# EAGLE design projeto_jcarlos(compacta) (EAGLE 6.2)
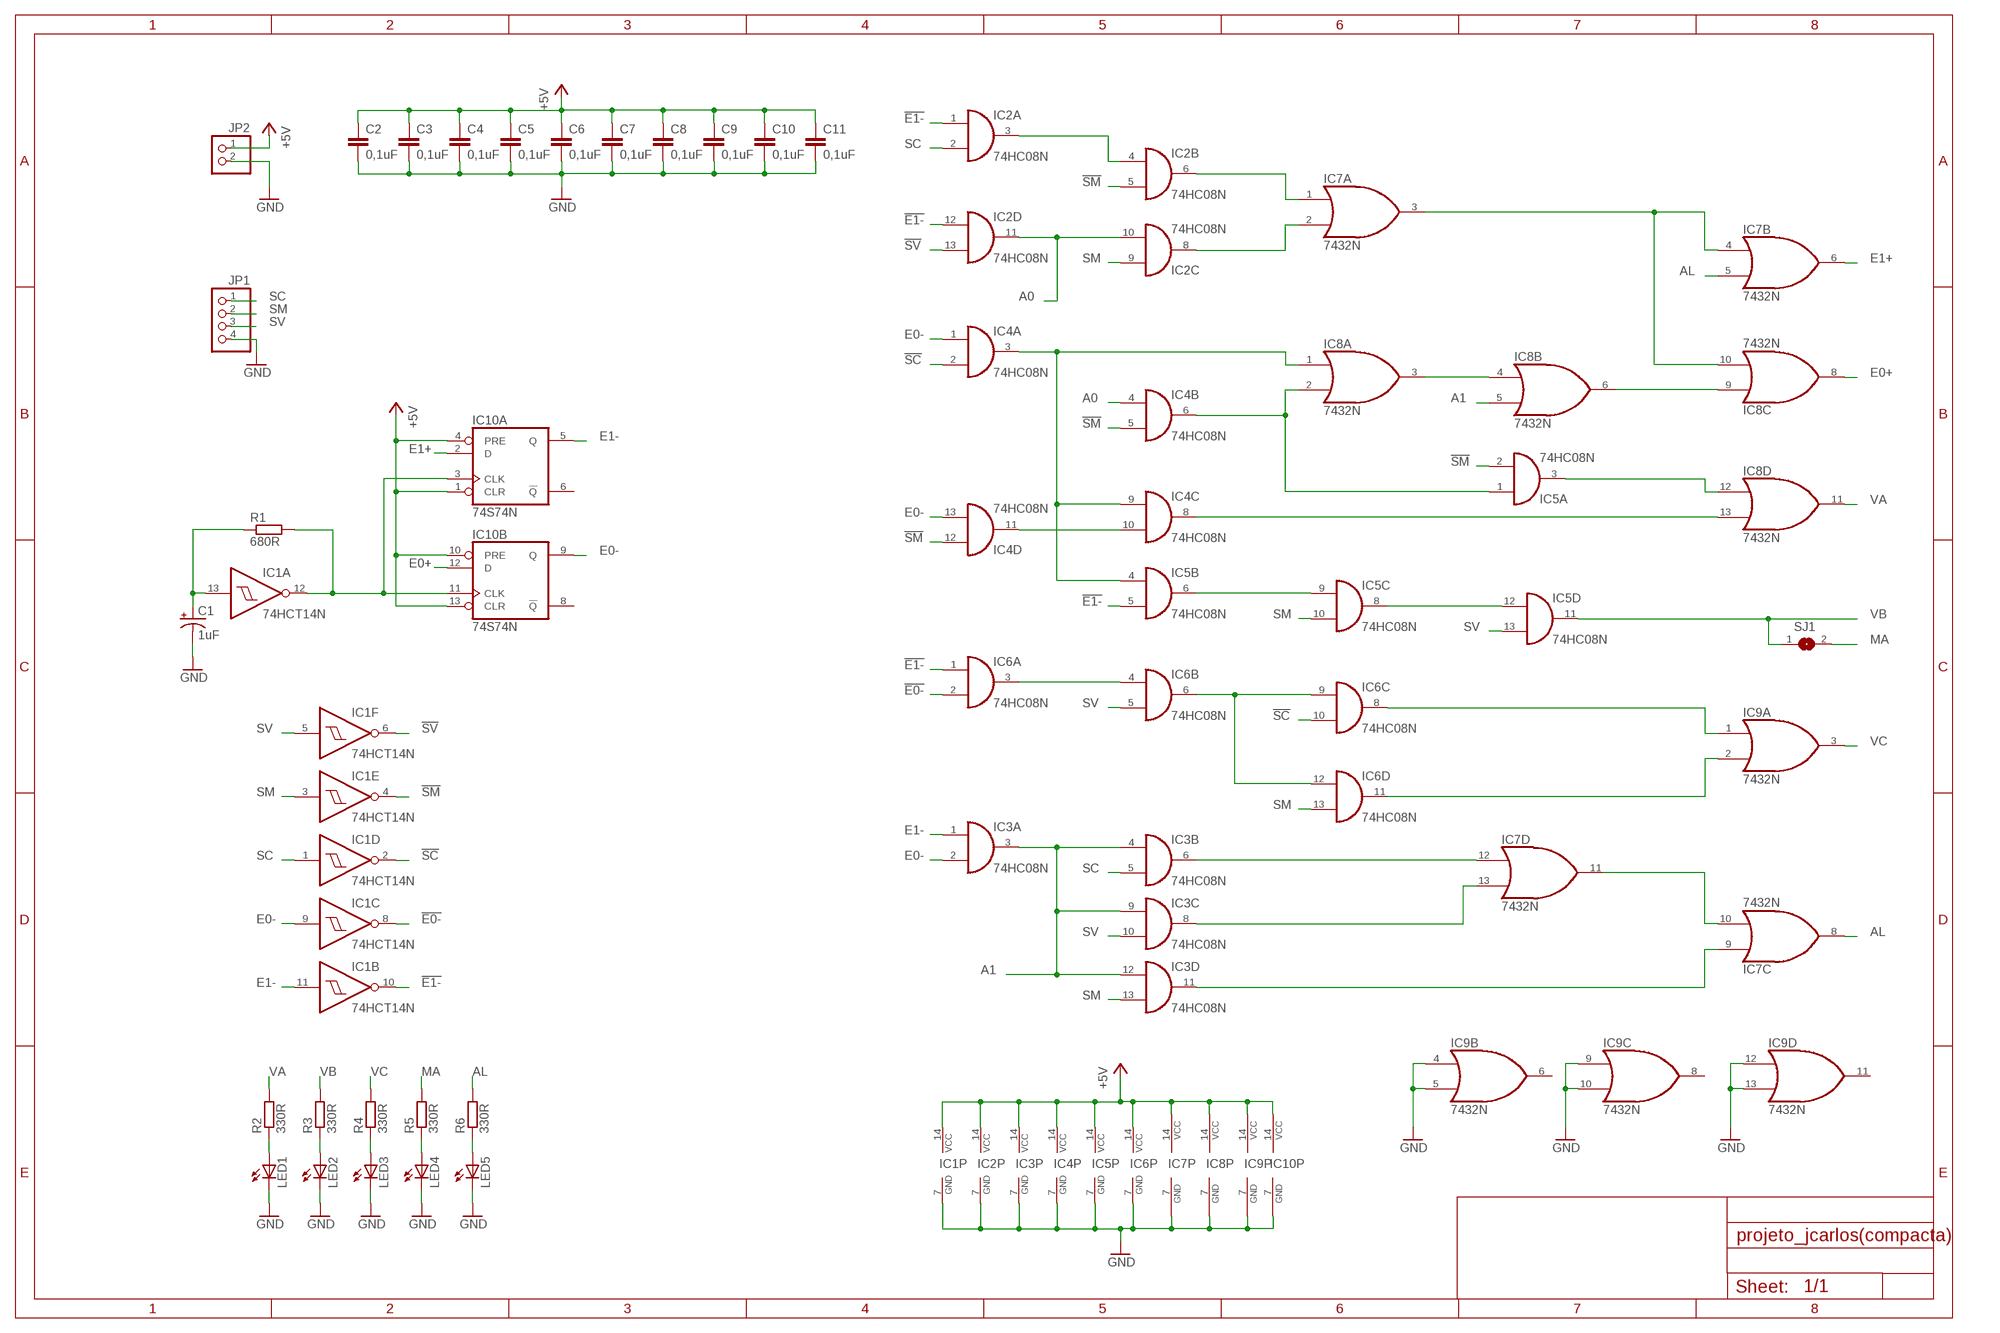
[diagram p0: schematic, sheet 1]

## Parts
C1  1uF  CPOL-USE5-6  [E5-6]
C2  0,1uF  C-EU025-025X050  [C025-025X050]
C3  0,1uF  C-EU025-025X050  [C025-025X050]
C4  0,1uF  C-EU025-025X050  [C025-025X050]
C5  0,1uF  C-EU025-025X050  [C025-025X050]
C6  0,1uF  C-EU025-025X050  [C025-025X050]
C7  0,1uF  C-EU025-025X050  [C025-025X050]
C8  0,1uF  C-EU025-025X050  [C025-025X050]
C9  0,1uF  C-EU025-025X050  [C025-025X050]
C10  0,1uF  C-EU025-025X050  [C025-025X050]
C11  0,1uF  C-EU025-025X050  [C025-025X050]
IC1  74HCT14N  [DIL14]
IC2  74HC08N  [DIL14]
IC3  74HC08N  [DIL14]
IC4  74HC08N  [DIL14]
IC5  74HC08N  [DIL14]
IC6  74HC08N  [DIL14]
IC7  7432N  [DIL14]
IC8  7432N  [DIL14]
IC9  7432N  [DIL14]
IC10  74S74N  [DIL14]
JP1  PINHD-1X4  [1X04]
JP2  PINHD-1X2  [1X02]
LED1  LED5MM  [LED5MM]
LED2  LED5MM  [LED5MM]
LED3  LED5MM  [LED5MM]
LED4  LED5MM  [LED5MM]
LED5  LED5MM  [LED5MM]
R1  680R  R-EU_0204/5  [0204/5]
R2  330R  R-EU_0204/5  [0204/5]
R3  330R  R-EU_0204/5  [0204/5]
R4  330R  R-EU_0204/5  [0204/5]
R5  330R  R-EU_0204/5  [0204/5]
R6  330R  R-EU_0204/5  [0204/5]
SJ1  SJ  [SJ]

## Nets
!E0-: IC1.8(C:O) IC6.2(A:I1)
!E1-: IC1.10(B:O) IC2.1(A:I0) IC2.12(D:I0) IC5.5(B:I1) IC6.1(A:I0)
!SC: IC1.2(D:O) IC4.2(A:I1) IC6.10(C:I1)
!SM: IC1.4(E:O) IC2.5(B:I1) IC4.5(B:I1) IC4.12(D:I0) IC5.2(A:I1)
!SV: IC1.6(F:O) IC2.13(D:I1)
+5V: C2.1 C3.1 C4.1 C5.1 C6.1 C7.1 C8.1 C9.1 C10.1 C11.1 IC1.14(P:VCC) IC2.14(P:VCC) IC3.14(P:VCC) IC4.14(P:VCC) IC5.14(P:VCC) IC6.14(P:VCC) IC7.14(P:VCC) IC8.14(P:VCC) IC9.14(P:VCC) IC10.1(A:CLR) IC10.4(A:PRE) IC10.10(B:PRE) IC10.13(B:CLR) IC10.14(P:VCC) JP2.1
A0: IC2.10(C:I1) IC2.11(D:O) IC4.4(B:I0)
A1: IC3.3(A:O) IC3.4(B:I0) IC3.9(C:I0) IC3.12(D:I0) IC8.5(B:I1)
AL: IC7.5(B:I1) IC7.8(C:O) R6.2
E0+: IC8.8(C:O) IC10.12(B:D)
E0-: IC1.9(C:I) IC3.2(A:I1) IC4.1(A:I0) IC4.13(D:I1) IC10.9(B:Q)
E1+: IC7.6(B:O) IC10.2(A:D)
E1-: IC1.11(B:I) IC3.1(A:I0) IC10.5(A:Q)
GND: C1.- C2.2 C3.2 C4.2 C5.2 C6.2 C7.2 C8.2 C9.2 C10.2 C11.2 IC1.7(P:GND) IC2.7(P:GND) IC3.7(P:GND) IC4.7(P:GND) IC5.7(P:GND) IC6.7(P:GND) IC7.7(P:GND) IC8.7(P:GND) IC9.4(B:I0) IC9.5(B:I1) IC9.7(P:GND) IC9.9(C:I0) IC9.10(C:I1) IC9.12(D:I0) IC9.13(D:I1) IC10.7(P:GND) JP1.4 JP2.2 LED1.K(C) LED2.K(C) LED3.K(C) LED4.K(C) LED5.K(C)
MA: R5.2 SJ1.2
N$1: IC5.6(B:O) IC5.9(C:I0)
N$2: IC7.3(A:O) IC7.4(B:I0) IC8.10(C:I1)
N$3: IC4.10(C:I1) IC4.11(D:O)
N$4: IC4.8(C:O) IC8.13(D:I1)
N$5: IC8.3(A:O) IC8.4(B:I0)
N$6: IC5.3(A:O) IC8.12(D:I0)
N$7: C1.+ IC1.13(A:I) R1.1
N$8: IC1.12(A:O) IC10.3(A:CLK) IC10.11(B:CLK) R1.2
N$9: IC8.6(B:O) IC8.9(C:I0)
N$10: IC4.3(A:O) IC4.9(C:I0) IC5.4(B:I0) IC8.1(A:I0)
N$11: IC5.8(C:O) IC5.12(D:I0)
N$12: IC4.6(B:O) IC5.1(A:I0) IC8.2(A:I1)
N$13: IC2.3(A:O) IC2.4(B:I0)
N$14: LED1.A R2.1
N$15: IC2.6(B:O) IC7.1(A:I0)
N$16: LED2.A R3.1
N$17: LED3.A R4.1
N$18: IC2.8(C:O) IC7.2(A:I1)
N$19: IC3.6(B:O) IC7.12(D:I0)
N$20: IC3.8(C:O) IC7.13(D:I1)
N$21: IC3.11(D:O) IC7.9(C:I0)
N$22: IC7.10(C:I1) IC7.11(D:O)
N$23: LED4.A R5.1
N$24: LED5.A R6.1
N$27: IC6.3(A:O) IC6.4(B:I0)
N$29: IC6.6(B:O) IC6.9(C:I0) IC6.12(D:I0)
N$32: IC6.8(C:O) IC9.1(A:I0)
N$33: IC6.11(D:O) IC9.2(A:I1)
SC: IC1.1(D:I) IC2.2(A:I1) IC3.5(B:I1) JP1.1
SM: IC1.3(E:I) IC2.9(C:I0) IC3.13(D:I1) IC5.10(C:I1) IC6.13(D:I1) JP1.2
SV: IC1.5(F:I) IC3.10(C:I1) IC5.13(D:I1) IC6.5(B:I1) JP1.3
VA: IC8.11(D:O) R2.2
VB: IC5.11(D:O) R3.2 SJ1.1
VC: IC9.3(A:O) R4.2
Unconnected: IC9.6(B:O) IC9.8(C:O) IC9.11(D:O) IC10.6(A:!Q) IC10.8(B:!Q)

## Library data of the parts
C1 = rcl:CPOL-US: POLARIZED CAPACITOR, American symbol; E5-6: E5-6
C2-C11 = rcl:C-EU: CAPACITOR, European symbol
IC1 = 74xx-eu:74*14: Hex schmitt trigger INVERTER
IC2-IC6 = 74xx-eu:74*08: Quad 2-input AND gate
IC7-IC9 = 74xx-us:74*32: Quad 2-input OR gate
IC10 = 74xx-us:74*74: Dual D type positive edge triggered FLIP FLOP, preset and clear
JP1 = pinhead:PINHD-1X4: PIN HEADER
JP2 = pinhead:PINHD-1X2: PIN HEADER
LED1-LED5 = led:LED: LED OSRAM: - CHIPLED LG R971, LG N971, LY N971, LG Q971, LY Q971, LO R971, LY R971 LH N974, LH R974 LS Q976, LO Q976, LY Q976 LO Q996 - Hyper CHIPLED LW Q18S LB Q993, LB Q99A, LB R99A - SideLED LS A670, LO A670, LY A670, LG A670, LP A670 LB A673, LV A673, LT A673, LW A673 LH A674 LY A675 LS A676, LA A676, LO A676, LY A676, LW A676 LS A679, LY A679, LG A679 - Hyper Micro SIDELED® LS Y876, LA Y876, LO Y876, LY Y876 LT Y87S - SmartLED LW L88C, LW L88S LB L89C, LB L89S, LG L890 LS L89K, LO L89K, LY L89K LS L896, LA L896, LO L896, LY L896 - TOPLED LS T670, LO T670, LY T670, LG T670, LP T670 LSG T670, LSP T670, LSY T670, LOP T670, LYG T670 LG T671, LOG T671, LSG T671 LB T673, LV T673, LT T673, LW T673 LH T674 LS T676, LA T676, LO T676, LY T676, LB T676, LH T676, LSB T676, LW T676 LB T67C, LV T67C, LT T67C, LS T67K, LO T67K, LY T67K, LW E67C LS E67B, LA E67B, LO E67B, LY E67B, LB E67C, LV E67C, LT E67C LW T67C LS T679, LY T679, LG T679 LS T770, LO T770, LY T770, LG T770, LP T770 LB T773, LV T773, LT T773, LW T773 LH T774 LS E675, LA E675, LY E675, LS T675 LS T776, LA T776, LO T776, LY T776, LB T776 LHGB T686 LT T68C, LB T68C - Hyper Mini TOPLED® LB M676 - Mini TOPLED Santana® LG M470 LS M47K, LO M47K, LY M47K Source: http://www.osram.convergy.de LUXEON: - LUMILED® LXK2-PW12-R00, LXK2-PW12-S00, LXK2-PW14-U00, LXK2-PW14-V00 LXK2-PM12-R00, LXK2-PM12-S00, LXK2-PM14-U00 LXK2-PE12-Q00, LXK2-PE12-R00, LXK2-PE12-S00, LXK2-PE14-T00, LXK2-PE14-U00 LXK2-PB12-K00, LXK2-PB12-L00, LXK2-PB12-M00, LXK2-PB14-N00, LXK2-PB14-P00, LXK2-PB14-Q00 LXK2-PR12-L00, LXK2-PR12-M00, LXK2-PR14-Q00, LXK2-PR14-R00 LXK2-PD12-Q00, LXK2-PD12-R00, LXK2-PD12-S00 LXK2-PH12-R00, LXK2-PH12-S00 LXK2-PL12-P00, LXK2-PL12-Q00, LXK2-PL12-R00 Source: www.luxeon.com KINGBRIGHT: KA-3528ASYC Source: www.kingbright.com
R1-R6 = rcl:R-EU_: RESISTOR, European symbol
SJ1 = jumper:SJ: SMD solder JUMPER

## Board
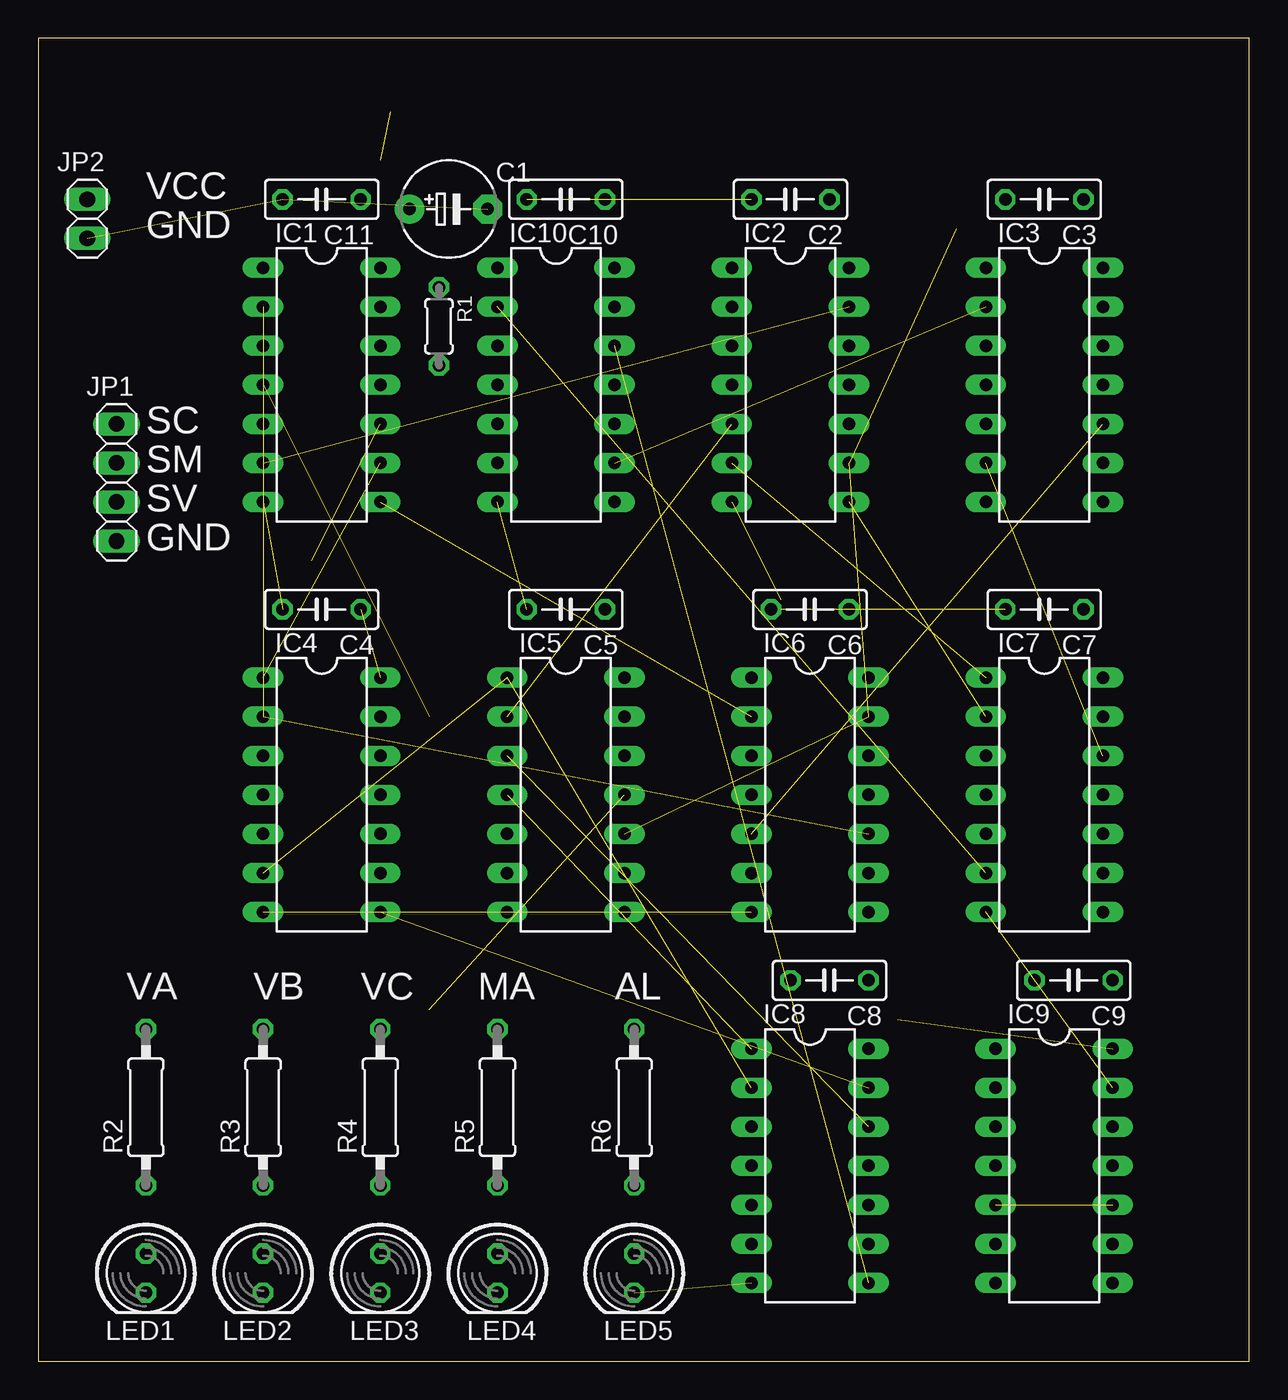
[diagram p1: board, top side]
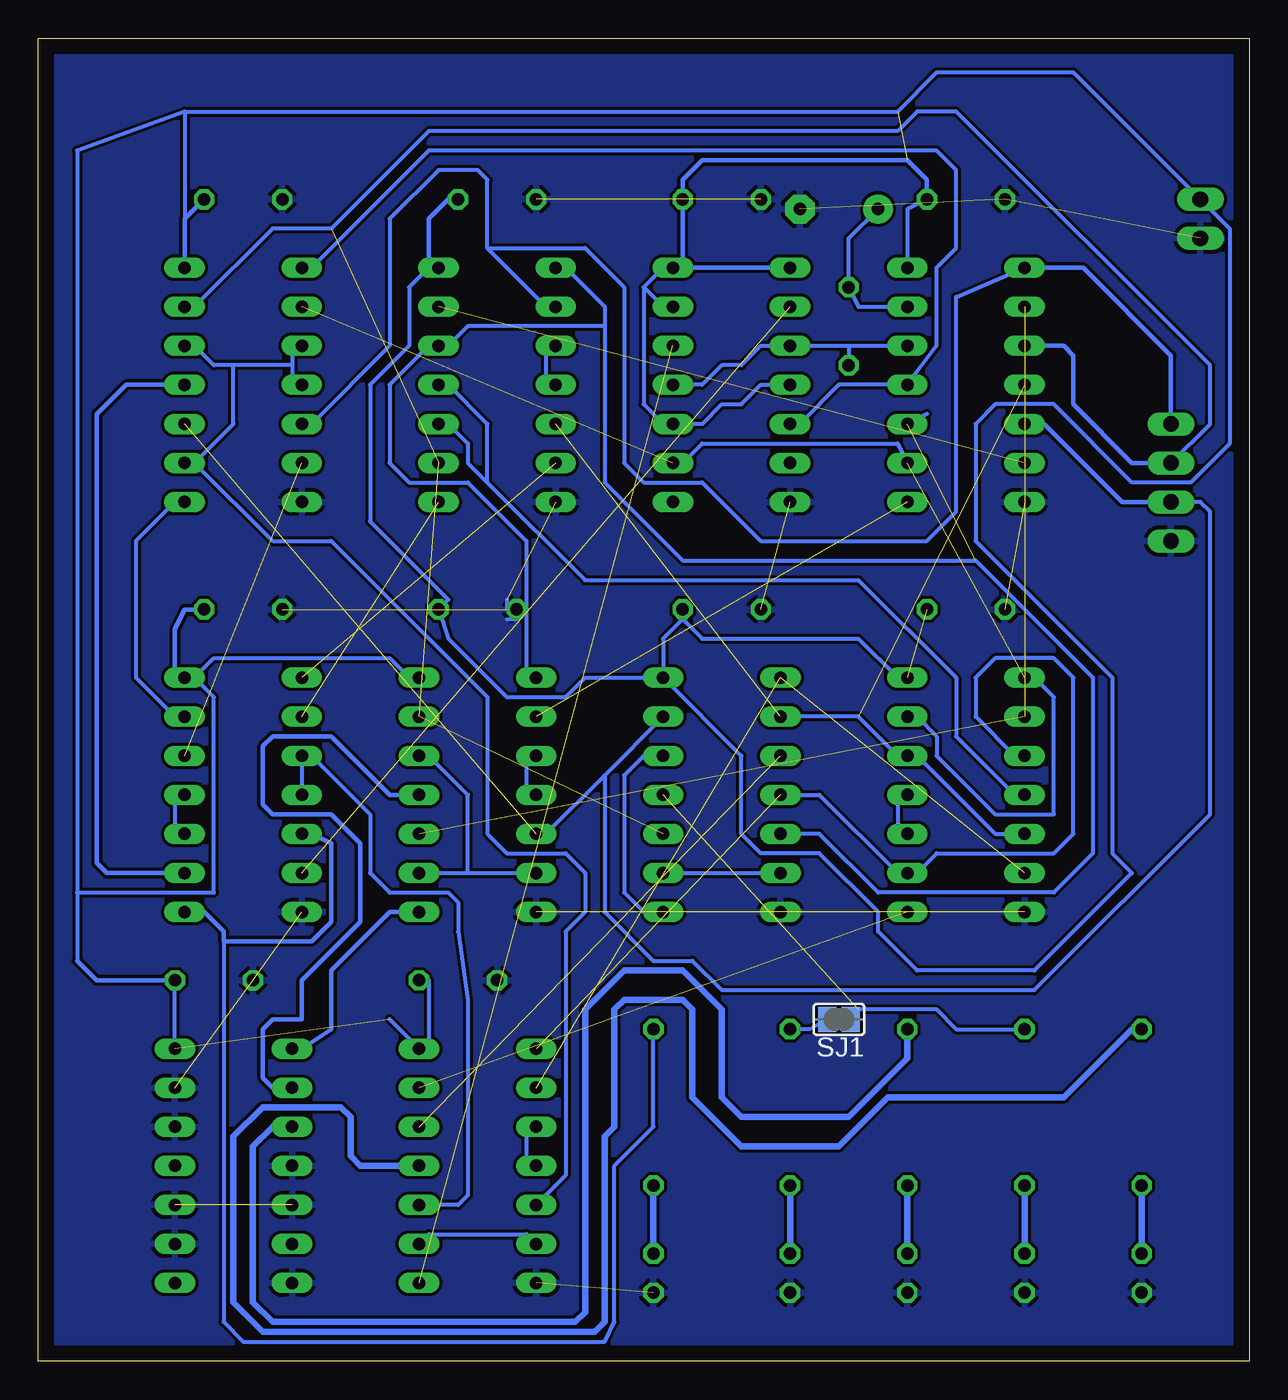
[diagram p2: board, bottom side, seen from below]

Size 78.72 x 86.03 mm. Coordinates in mm from the lower left corner, seen from the top.
Outline: 0,0 78.72,0 78.72,86.03 0,86.03 0,0
Copper layers (1*16): Top 0.035mm / dielectric 1.5mm / Bottom 0.035mm
Design rules: minimum track width 10mil, minimum drill 24mil, track to track 8mil, track to pad 8mil, pad to pad 8mil, via to via 8mil, smd to smd 8mil, copper to edge 40mil, drill to drill 8mil, minimum pad ring 10mil, minimum via ring 8mil, stop-mask expansion 4mil, vias tented up to drill 0mil, thermal gap 10mil

### Footprints (pad centres in the part's own frame; a part is rotated, then mirrored left to right if it is on the bottom)
E5-6 = drill 0.813 pad 1.905: + -2.54,0 | drill 0.813 pad 1.905 octagon: - 2.54,0
C050-025X075 = drill 0.813 octagon: 1 -2.54,0; 2 2.54,0
DIL14 = drill 0.813 long: 1 -7.62,-3.81; 2 -5.08,-3.81; 3 -2.54,-3.81; 4 0,-3.81; 5 2.54,-3.81; 6 5.08,-3.81; 7 7.62,-3.81; 8 7.62,3.81; 9 5.08,3.81; 10 2.54,3.81; 11 0,3.81; 12 -2.54,3.81; 13 -5.08,3.81; 14 -7.62,3.81
1X04 = drill 1.016 long: 1 -3.81,0; 2 -1.27,0; 3 1.27,0; 4 3.81,0
1X02 = drill 1.016 long: 1 -1.27,0; 2 1.27,0
LED5MM = drill 0.813 octagon: A -1.27,0; K 1.27,0
0204/5 = drill 0.813 octagon: 1 -2.54,0; 2 2.54,0
0207/10 = drill 0.813 octagon: 1 -5.08,0; 2 5.08,0
SJ = smd 1.168 x 1.6: 1 -0.762,0; 2 0.762,0

### Placement (x,y rotation side)
C1  26.67,74.93 0 top
C2  0,1uF  [C050-025X075]  48.9,75.56 180 top
C3  0,1uF  [C050-025X075]  65.41,75.56 180 top
C4  0,1uF  [C050-025X075]  18.41,48.9 180 top
C5  0,1uF  [C050-025X075]  34.29,48.9 180 top
C6  0,1uF  [C050-025X075]  50.16,48.9 180 top
C7  0,1uF  [C050-025X075]  65.41,48.9 180 top
C8  0,1uF  [C050-025X075]  51.44,24.77 180 top
C9  0,1uF  [C050-025X075]  67.31,24.77 180 top
C10  0,1uF  [C050-025X075]  34.29,75.56 180 top
C11  0,1uF  [C050-025X075]  18.41,75.56 180 top
IC1  18.41,63.5 270 top
IC2  48.9,63.5 270 top
IC3  65.41,63.5 270 top
IC4  18.41,36.83 270 top
IC5  34.29,36.83 270 top
IC6  50.16,36.83 270 top
IC7  65.41,36.83 270 top
IC8  50.16,12.7 270 top
IC9  66.04,12.7 270 top
IC10  33.66,63.5 270 top
JP1  5.08,57.15 270 top
JP2  3.17,74.3 270 top
LED1  6.99,5.71 270 top
LED2  14.61,5.71 270 top
LED3  22.23,5.71 270 top
LED4  29.84,5.71 270 top
LED5  38.73,5.71 270 top
R1  26.04,67.31 270 top
R2  330R  [0207/10]  6.99,16.51 90 top
R3  330R  [0207/10]  14.61,16.51 90 top
R4  330R  [0207/10]  22.23,16.51 90 top
R5  330R  [0207/10]  29.84,16.51 90 top
R6  330R  [0207/10]  38.73,16.51 90 top
SJ1  26.67,22.23 180 bottom

### Tracks (layer width: path | path; a pad name or v marks a point on that pad's centre or on a via)
!E0-  (1 unrouted)
!E1-  (1 unrouted)
  Bottom 0.254: IC6.1 46.99,44.45 46.99,53.34 50.8,57.15 54.61,57.15 55.88,58.42 55.88,63.5 53.34,66.04 IC2.12 52.07,66.04 50.8,67.31 41.91,67.31 | IC5.5 27.94,34.29 24.13,30.48 12.7,30.48 10.16,33.02 10.16,44.45 17.78,52.07 36.83,52.07 41.91,57.15 41.91,67.31 | 41.91,67.31 41.91,68.58 44.45,71.12 IC2.1 | 20.95,61.59 IC1.10
!SC  (2 unrouted)
!SM  (2 unrouted)
  Bottom 0.254: IC4.5 16.51,34.29 21.59,39.37 IC4.12 22.86,39.37 25.4,41.91 IC5.2
!SV  (1 unrouted)
+5V  (3 unrouted)
  Bottom 0.254: 36.83,48.26 35.56,46.99 25.4,46.99 22.86,44.45 IC4.14 | IC5.14 38.1,46.99 36.83,48.26 | 36.83,48.26 C5.1 | IC2.14 53.34,71.12 54.61,69.85 54.61,66.04 57.15,63.5 57.15,54.61 52.07,49.53 C6.1 52.07,46.99 48.26,43.18 44.45,43.18 43.18,44.45 IC5.14 | 68.58,44.45 67.31,45.72 55.88,45.72 54.61,44.45 IC6.14 | C8.1 53.34,24.77 53.34,20.95 IC8.14 55.88,22.23 | IC9.14 C9.1 | C11.1 22.23,74.93 IC1.14 | 29.21,71.12 IC10.1 36.83,71.12 IC10.14 38.1,71.12 39.37,69.85 | IC10.4 31.75,63.5 33.02,62.23 34.29,62.23 35.56,60.96 IC10.10 38.1,60.96 39.37,62.23 39.37,69.85 | 76.2,30.48 76.2,78.74 69.22,81.28 | 76.2,30.48 76.2,26.04 | 68.58,44.45 67.31,43.18 67.31,30.48 76.2,30.48 | 68.58,44.45 IC7.14 | 39.37,69.85 38.1,68.58 IC10.13 | 69.22,81.28 22.86,81.28 20.32,83.82 11.43,83.82 JP2.1 1.27,73.66 1.27,59.69 3.81,57.15 7.62,57.15 12.7,62.23 16.51,62.23 17.78,60.96 17.78,53.34 8.89,44.45 8.89,33.02 7.62,31.75 13.97,25.4 21.59,25.4 24.13,27.94 24.13,29.21 27.94,33.02 31.75,33.02 33.02,34.29 33.02,39.37 IC5.14 | 69.22,81.28 IC3.14
  Bottom 0.305: C7.1 69.22,48.9 69.85,47.62 69.85,45.09 IC7.14 | 76.2,26.04 74.93,24.77 C9.1 | IC3.14 69.22,74.3 C3.1 | C2.1 52.07,75.56 53.34,74.3 53.34,71.75 IC2.14 | 29.21,71.12 36.83,71.12 C10.1 36.83,76.83 35.56,78.11 22.23,78.11 20.95,76.83 C11.1
A0
  Bottom 0.254: 49.53,57.15 50.8,58.42 50.8,59.69 52.07,60.96 IC2.10 | 49.53,57.15 43.18,50.8 25.4,50.8 19.05,44.45 19.05,40.64 15.24,36.83 IC4.4 | 49.53,57.15 49.53,60.96 52.07,63.5 IC2.11
A1
  Bottom 0.254: 62.23,64.77 62.23,66.04 IC3.3 | 62.23,64.77 62.23,63.5 IC3.4 | 62.23,64.77 66.04,64.77 | 66.04,64.77 67.31,64.77 68.58,66.04 IC3.12 | IC8.5 44.45,12.06 44.45,27.94 43.18,29.21 43.18,31.75 44.45,33.02 48.26,33.02 49.53,34.29 49.53,43.18 59.69,53.34 63.5,53.34 68.58,58.42 | 66.04,64.77 66.04,60.96 68.58,58.42 | 68.58,58.42 IC3.9
AL
  Bottom 0.254: 66.67,27.3 66.67,2.54 65.41,1.27 41.91,1.27 41.27,2.54 41.27,12.7 38.73,15.24 R6.2 | 60.96,34.29 IC7.5
  Bottom 0.305: 60.96,34.29 59.69,33.66 59.69,28.57 60.96,27.3 66.67,27.3 66.67,27.94 67.94,29.21 IC7.8
E0+  (1 unrouted)
E0-  (2 unrouted)
  Bottom 0.254: IC1.9 22.86,59.69 35.56,59.69 36.83,58.42 IC10.9 | IC4.1 13.97,44.45 12.7,43.18 12.7,35.56 16.51,35.56 20.32,39.37 20.32,40.64 21.59,41.91 IC4.13
E1+  (1 unrouted)
E1-
  Bottom 0.254: IC10.5 29.21,60.96 26.67,63.5 IC1.11 20.32,66.04 20.32,71.12 19.05,72.39 19.05,77.47 20.32,78.74 53.34,78.74 60.96,71.12 IC3.1
GND  (13 unrouted)
  Bottom 0.254: 48.26,49.53 48.26,48.9 | 48.26,48.26 47.62,48.26
  pour Bottom: -1.91,87 79.38,87 80.01,-1.27 -1.27,-1.27
MA
  Bottom 0.254: SJ1.2 28.57,21.59 R5.2
N$1
  Bottom 0.254: IC5.9 IC5.6
N$2
  Bottom 0.254: IC8.10 51.44,10.16 50.8,10.79 50.8,23.5 51.44,27.94 51.44,29.84 52.07,30.48 55.88,30.48 57.15,31.75 57.15,35.56 60.96,39.37 IC7.3 IC7.4
N$3
  Bottom 0.254: IC4.10 22.86,34.29 22.86,36.83 IC4.11
N$4  (1 unrouted)
N$5
  Bottom 0.254: IC8.4 46.99,13.34 46.99,14.61 IC8.3
N$6  (1 unrouted)
N$7
  Bottom 0.254: IC1.13 25.4,68.58 R1.1 26.04,73.03 C1.+
N$8
  Bottom 0.254: IC10.11 35.56,63.5 34.29,64.77 33.02,64.77 31.75,66.04 IC10.3 26.04,66.04 | 26.04,66.04 IC1.12 | 26.04,66.04 R1.2
N$9
  Bottom 0.254: IC8.6 46.99,8.26 53.34,8.26 IC8.9
N$10  (1 unrouted)
  Bottom 0.254: IC5.4 27.94,36.83 22.86,31.75 IC4.9 21.59,31.75 20.32,33.02 12.7,33.02 11.43,34.29 11.43,44.45 12.7,45.72 16.51,45.72 17.78,44.45 17.78,41.91 15.24,39.37 IC4.3
N$11
  Bottom 0.254: IC5.8 39.37,29.21 40.64,30.48 40.64,38.1 39.37,39.37 IC5.12
N$12  (2 unrouted)
N$13
  Bottom 0.254: IC2.4 45.72,63.5 45.72,66.04 IC2.3
N$14
  Bottom 0.406: R2.1 LED1.A
N$15  (1 unrouted)
N$16
  Bottom 0.406: R3.1 LED2.A
N$17
  Bottom 0.406: R4.1 LED3.A
N$18  (1 unrouted)
N$19  (1 unrouted)
N$20
  Bottom 0.254: IC7.13 69.85,41.91 72.39,44.45 72.39,53.34 69.85,55.88 IC3.8
N$21
  Bottom 0.305: IC3.11 73.03,63.5 74.93,61.59 74.93,32.38 74.3,31.75 IC7.9
N$22
  Bottom 0.254: IC7.10 69.85,34.29 69.85,36.83 IC7.11
N$23
  Bottom 0.406: R5.1 LED4.A
N$24
  Bottom 0.406: R6.1 LED5.A
N$27
  Bottom 0.254: IC6.4 46.99,36.83 46.99,39.37 IC6.3
N$29
  Bottom 0.254: IC6.9 50.8,31.75 | 50.8,31.75 IC6.6 | 50.8,31.75 50.8,36.83 53.34,39.37 IC6.12
N$32
  Bottom 0.305: IC6.8 55.88,29.21 59.69,25.4 59.69,21.59 61.59,20.32 IC9.1
N$33
  Bottom 0.305: IC9.2 63.5,17.78 64.14,18.41 64.14,21.59 63.5,22.23 61.59,22.23 61.59,24.77 57.78,28.57 57.78,33.66 59.69,35.56 63.5,35.56 64.14,36.2 64.14,40.01 63.5,40.64 59.69,40.64 55.88,36.83 IC6.11
SC
  Bottom 0.254: 49.53,72.39 49.53,76.83 50.16,77.47 52.7,77.47 55.88,74.3 55.88,66.04 60.96,60.96 IC3.5 | 49.53,72.39 45.72,68.58 IC2.2 | IC1.1 19.05,69.22 19.05,55.24 20.95,53.34 31.75,53.34 35.56,57.15 39.37,57.15 40.64,58.42 40.64,69.85 43.18,72.39 49.53,72.39
  Bottom 0.305: JP1.1 5.08,65.41 10.79,71.12 IC1.1
SM  (3 unrouted)
  Bottom 0.254: JP1.2 2.54,60.96 2.54,64.77 19.05,81.28 21.59,81.28 22.86,80.01 53.34,80.01 59.69,73.66 63.5,73.66 68.58,68.58 IC3.13
  Bottom 0.305: JP1.2 7.62,58.42 11.43,62.23 11.43,65.41 12.06,66.04 IC1.3
SV  (1 unrouted)
  Bottom 0.254: IC5.13 41.91,38.1 | 41.91,38.1 45.72,34.29 IC6.5 | JP1.3 3.17,55.88 2.54,55.24 2.54,35.56 13.97,24.13 34.29,24.13 36.2,26.04 38.73,26.04 41.91,29.21 41.91,38.1
  Bottom 0.305: JP1.3 8.26,55.88 13.34,60.96 IC1.5
VA
  Bottom 0.406: R2.2 7.62,21.59 12.06,17.14 23.5,17.14 26.67,13.97 33.02,13.97 36.2,17.14 36.2,22.86 36.83,23.5 40.64,23.5 41.27,22.86 41.27,15.24 41.91,14.61 41.91,2.54 42.55,1.91 64.14,1.91 66.04,3.81 66.04,14.61 64.14,16.51 59.05,16.51 58.42,15.88 58.42,13.34 57.78,12.7 IC8.11
VB  (1 unrouted)
  Bottom 0.254: SJ1.1 25.4,22.86 20.32,22.86 19.05,21.59 R3.2
VC
  Bottom 0.406: R4.2 22.23,19.68 26.04,15.88 33.02,15.88 34.29,17.14 34.29,22.86 36.83,25.4 40.64,25.4 43.18,22.86 43.18,3.17 43.81,2.54 63.5,2.54 64.77,3.81 64.77,13.97 63.5,15.24 IC9.3

### Text on the board
tNames: VCC | GND | SC | SM | SV | GND | VA | VB | VC | MA | AL